# Altium schematic sheet [XX] - DOC REVISION HISTORY.SchDoc: =title
size A3; DocumentNumber: 4; SheetNumber: 4; SheetTotal: 4
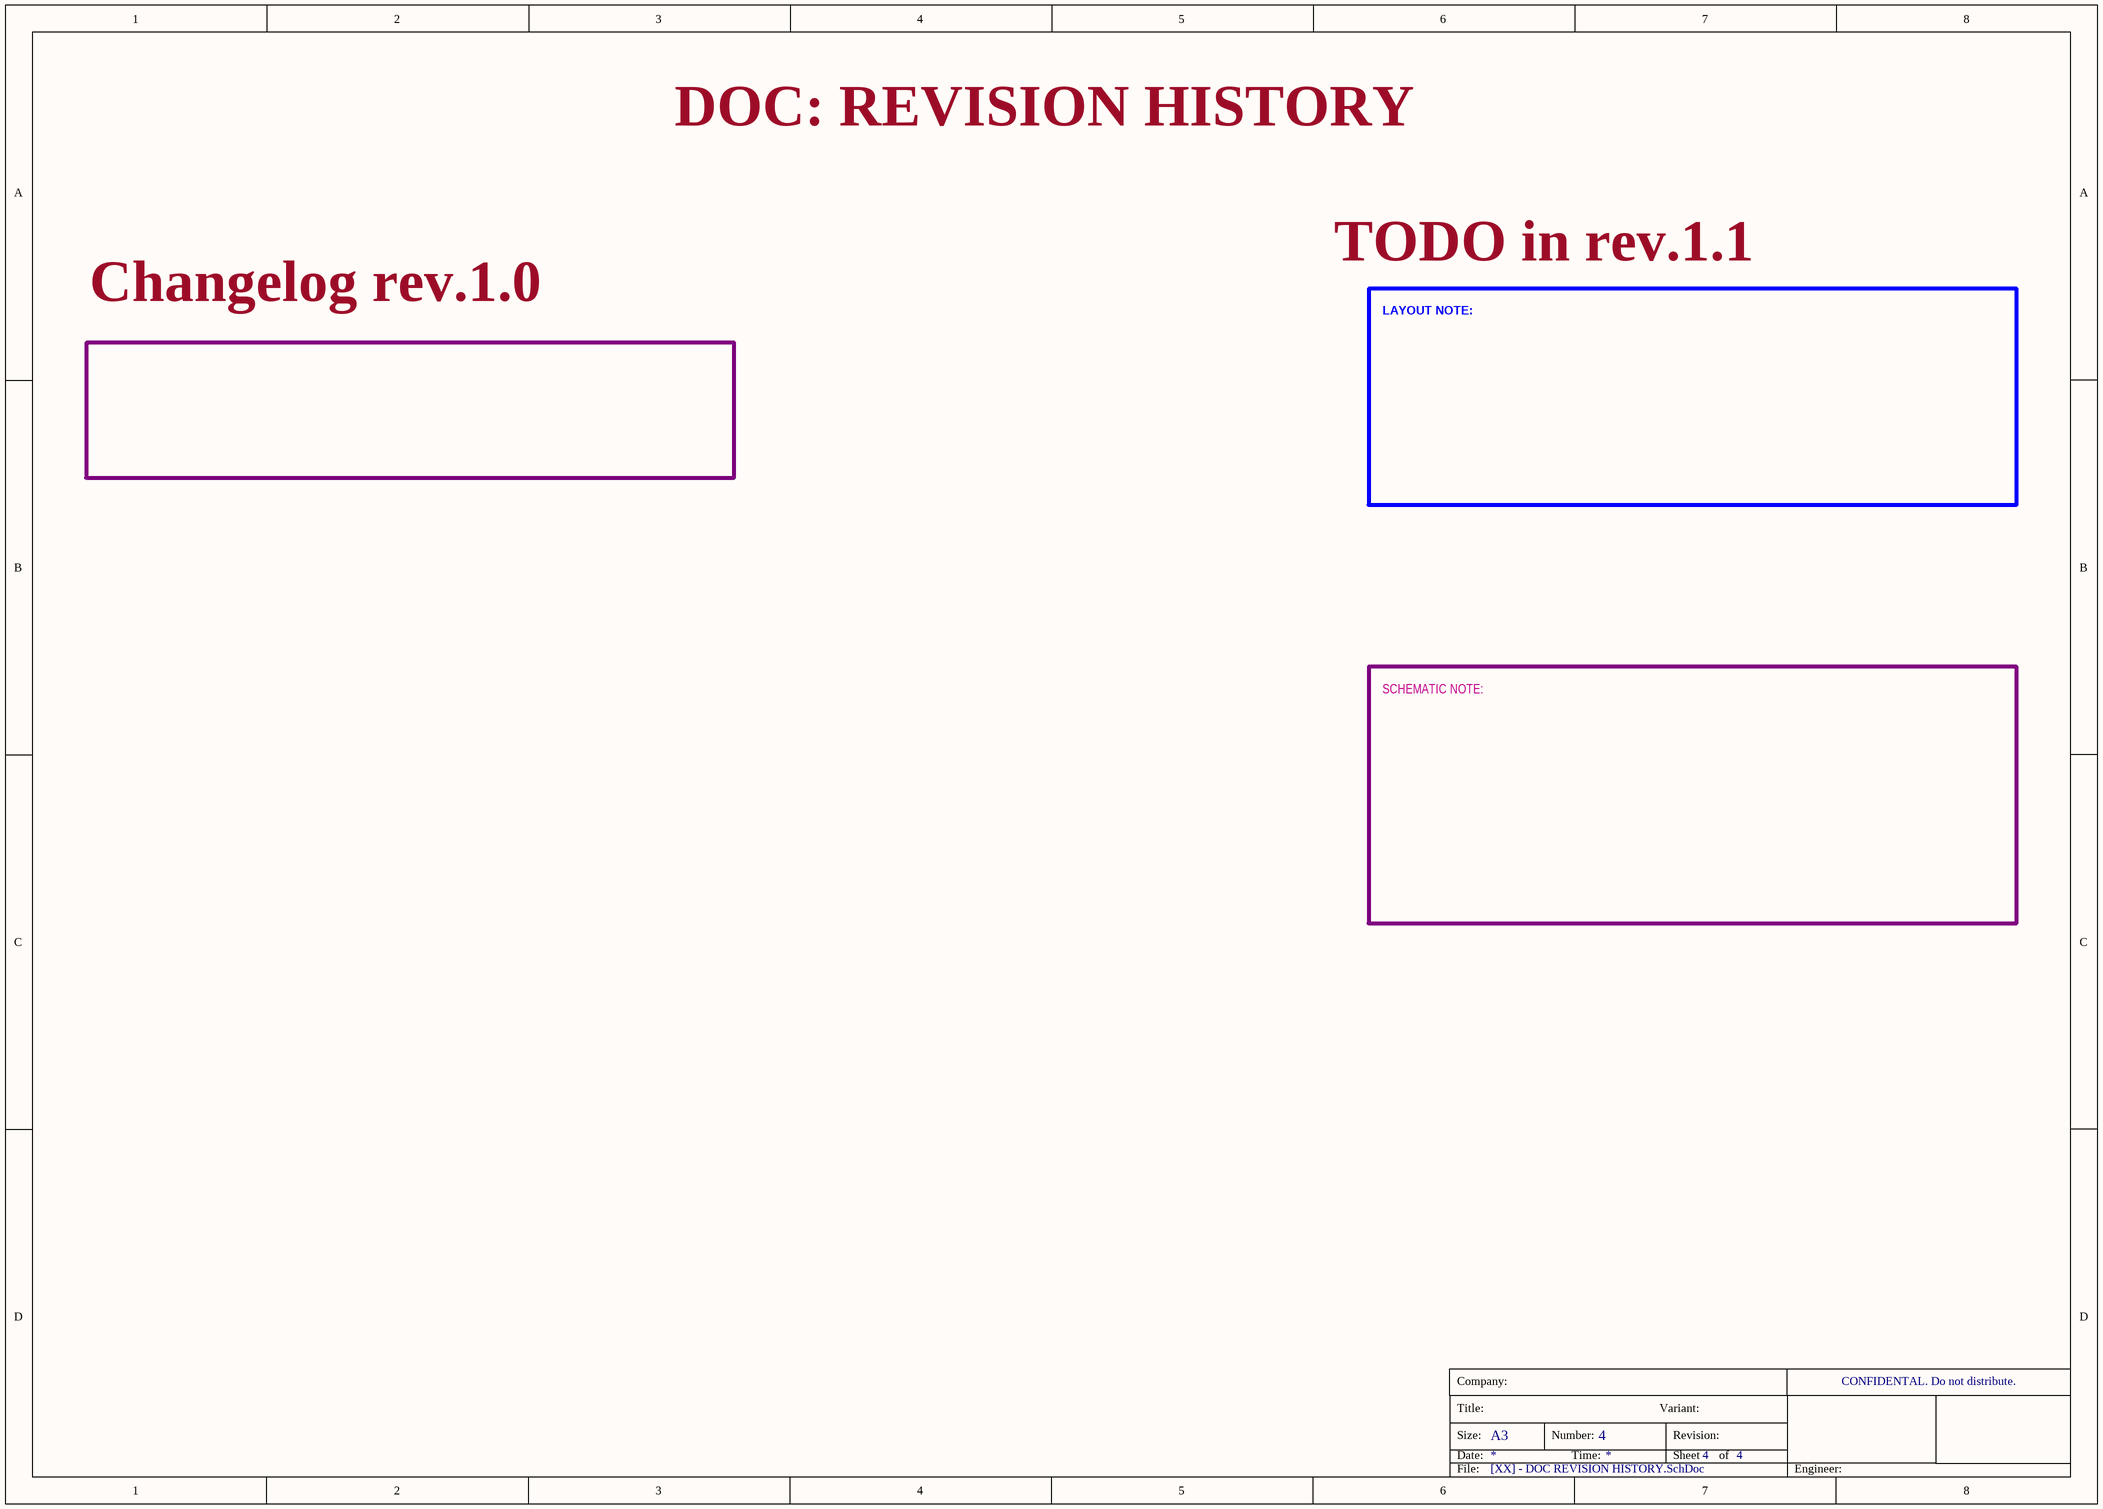
[diagram p0: [XX] - DOC REVISION HISTORY.SchDoc]

## Notes on the sheet
- DOC: REVISION HISTORY
- Changelog rev.1.0
- TODO in rev.1.1
- LAYOUT NOTE:
- SCHEMATIC NOTE:
- CLOCKS (CPU & PCIE)
- Company:
- CONFIDENTAL. Do not distribute.
- Title:
- Size:
- Date:
- A3
- Number:
- Time:
- Variant:
- Revision:
- Sheet
- of
- File:
- Engineer: